# Altium schematic sheet EVENTCTRL_FPGA.SchDoc: FPGA
size A3; Author: ZLY; DocumentNumber: 9321-E-1102-EMRT EVENT CONTROLLER ACQ; Revision: 1.0; SheetNumber: 6; SheetTotal: 6
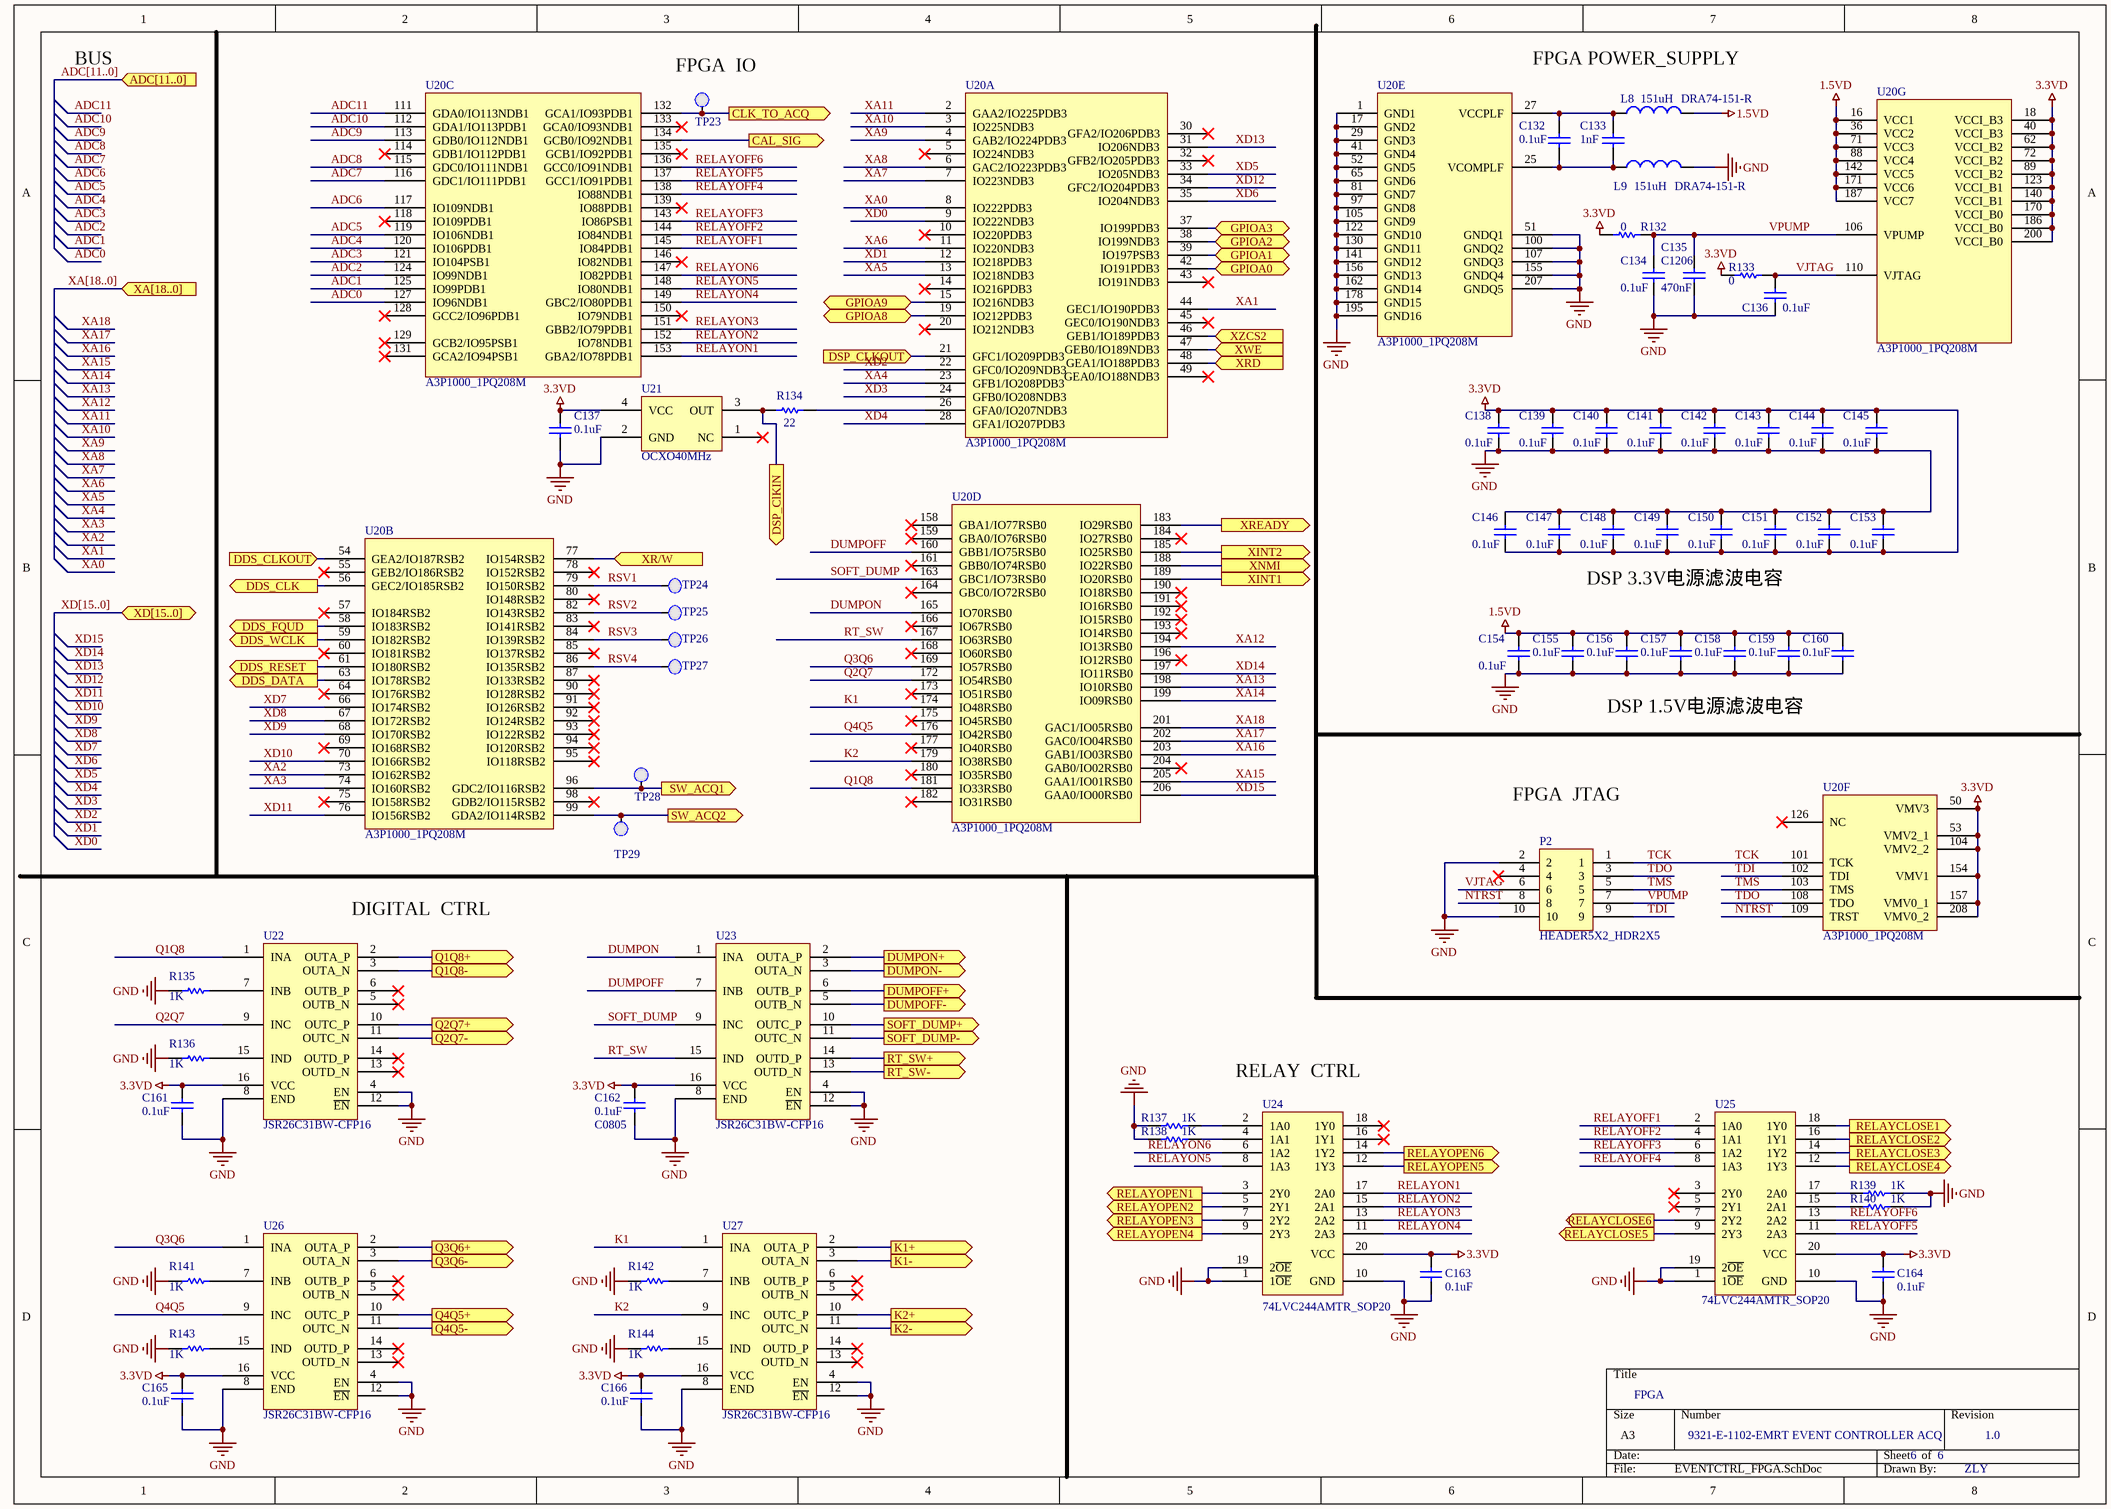
[diagram p0: EVENTCTRL_FPGA.SchDoc]

## Parts
C132  value 0.1uF  [0805]  (hidden comment: C0805)
C133  value 1nF  [0805]  (hidden comment: C0805)
C134  value 0.1uF  [0805]  (hidden comment: C0805)
C135  C1206  value 470nF  [1206]
C136  value 0.1uF  [0805]  (hidden comment: C0805)
C137  value 0.1uF  [0805]  (hidden comment: C0805)
C138  value 0.1uF  [0805]  (hidden comment: C0805)
C139  value 0.1uF  [0805]  (hidden comment: C0805)
C140  value 0.1uF  [0805]  (hidden comment: C0805)
C141  value 0.1uF  [0805]  (hidden comment: C0805)
C142  value 0.1uF  [0805]  (hidden comment: C0805)
C143  value 0.1uF  [0805]  (hidden comment: C0805)
C144  value 0.1uF  [0805]  (hidden comment: C0805)
C145  value 0.1uF  [0805]  (hidden comment: C0805)
C146  value 0.1uF  [0805]  (hidden comment: C0805)
C147  value 0.1uF  [0805]  (hidden comment: C0805)
C148  value 0.1uF  [0805]  (hidden comment: C0805)
C149  value 0.1uF  [0805]  (hidden comment: C0805)
C150  value 0.1uF  [0805]  (hidden comment: C0805)
C151  value 0.1uF  [0805]  (hidden comment: C0805)
C152  value 0.1uF  [0805]  (hidden comment: C0805)
C153  value 0.1uF  [0805]  (hidden comment: C0805)
C154  value 0.1uF  [0805]  (hidden comment: C0805)
C155  value 0.1uF  [0805]  (hidden comment: C0805)
C156  value 0.1uF  [0805]  (hidden comment: C0805)
C157  value 0.1uF  [0805]  (hidden comment: C0805)
C158  value 0.1uF  [0805]  (hidden comment: C0805)
C159  value 0.1uF  [0805]  (hidden comment: C0805)
C160  value 0.1uF  [0805]  (hidden comment: C0805)
C161  value 0.1uF  [0805]  (hidden comment: C0805)
C162  value 0.1uF  [0805]  (hidden comment: C0805)
C163  value 0.1uF  [0805]  (hidden comment: C0805)
C164  value 0.1uF  [0805]  (hidden comment: C0805)
C165  value 0.1uF  [0805]  (hidden comment: C0805)
C166  value 0.1uF  [0805]  (hidden comment: C0805)
L8  DRA74-151-R  value 151uH  [DRA74-151-R]
L9  DRA74-151-R  value 151uH  [DRA74-151-R]
P2  HEADER5X2_HDR2X5  [HDR2X5]
R132  value 0  [R0805]  (hidden comment: R0805)
R133  value 0  [R0805]  (hidden comment: R0805)
R134  value 22  [R0805]  (hidden comment: R0805)
R135  value 1K  [R0805]  (hidden comment: R0805)
R136  value 1K  [R0805]  (hidden comment: R0805)
R137  value 1K  [R0805]  (hidden comment: R0805)
R138  value 1K  [R0805]  (hidden comment: R0805)
R139  value 1K  [R0805]  (hidden comment: R0805)
R140  value 1K  [R0805]  (hidden comment: R0805)
R141  value 1K  [R0805]  (hidden comment: R0805)
R142  value 1K  [R0805]  (hidden comment: R0805)
R143  value 1K  [R0805]  (hidden comment: R0805)
R144  value 1K  [R0805]  (hidden comment: R0805)
TP23  TP  [TPA]  (value not drawn)
TP24  TP  [TPA]  (value not drawn)
TP25  TP  [TPA]  (value not drawn)
TP26  TP  [TPA]  (value not drawn)
TP27  TP  [TPA]  (value not drawn)
TP28  TP  [TPA]  (value not drawn)
TP29  TP  [TPA]  (value not drawn)
U20  A3P1000_1PQ208M  [PQFP208]  (parts A,B,C,D,E,F,G of 7)
U21  OCXO40MHz  [OCX1]
U22  JSR26C31BW-CFP16  [W16A]
U23  JSR26C31BW-CFP16  [W16A]
U24  74LVC244AMTR_SOP20  [SOP20]
U25  74LVC244AMTR_SOP20  [SOP20]
U26  JSR26C31BW-CFP16  [W16A]
U27  JSR26C31BW-CFP16  [W16A]

## Ports
ADC[11..0] (in), CAL_SIG (out), CLK_TO_ACQ (out), DDS_CLK (out), DDS_CLKOUT (in), DDS_DATA (out), DDS_FQUD (out), DDS_RESET (out), DDS_WCLK (out), DSP_ClKIN (out), DSP_CLKOUT (in), DUMPOFF+ (out), DUMPOFF- (out), DUMPON+ (out), DUMPON- (out), GPIOA0 (bidir), GPIOA1 (bidir), GPIOA2 (bidir), GPIOA3 (bidir), GPIOA8 (bidir), GPIOA9 (bidir), K1+ (out), K1- (out), K2+ (out), K2- (out), Q1Q8+ (out), Q1Q8- (out), Q2Q7+ (out), Q2Q7- (out), Q3Q6+ (out), Q3Q6- (out), Q4Q5+ (out), Q4Q5- (out), RELAYCLOSE1 (out), RELAYCLOSE2 (out), RELAYCLOSE3 (out), RELAYCLOSE4 (out), RELAYCLOSE5 (out), RELAYCLOSE6 (out), RELAYOPEN1 (out), RELAYOPEN2 (out), RELAYOPEN3 (out), RELAYOPEN4 (out), RELAYOPEN5 (out), RELAYOPEN6 (out), RT_SW+ (out), RT_SW- (out), SOFT_DUMP+ (out), SOFT_DUMP- (out), SW_ACQ1 (out), SW_ACQ2 (out), XA[18..0] (in), XD[15..0] (bidir), XINT1 (out), XINT2 (out), XNMI (out), XR/W (in), XRD (in), XREADY (out), XWE (in), XZCS2 (in)

## Nets
1.5VD: C154.1 C155.1 C156.1 C157.1 C158.1 C159.1 C160.1 L8.2 U20.16(VCC1) U20.36(VCC2) U20.71(VCC3) U20.88(VCC4) U20.142(VCC5) U20.171(VCC6) U20.187(VCC7)
3.3VD: C137.1 C138.1 C139.1 C140.1 C141.1 C142.1 C143.1 C144.1 C145.1 C146.2 C147.2 C148.2 C149.2 C150.2 C151.2 C152.2 C153.2 C161.1 C162.1 C163.2 C164.2 C165.1 C166.1 R132.1 R133.1 U20.18(VCCI_B3) U20.40(VCCI_B3) U20.50(VMV3) U20.53(VMV2_1) U20.62(VCCI_B2) U20.72(VCCI_B2) U20.89(VCCI_B2) U20.104(VMV2_2) U20.123(VCCI_B1) U20.140(VCCI_B1) U20.154(VMV1) U20.157(VMV0_1) U20.170(VCCI_B0) U20.186(VCCI_B0) U20.200(VCCI_B0) U20.208(VMV0_2) U21.4(VCC) U22.16(VCC) U23.16(VCC) U24.20(VCC) U25.20(VCC) U26.16(VCC) U27.16(VCC)
GND: C134.2 C135.2 C136.2 C137.2 C138.2 C139.2 C140.2 C141.2 C142.2 C143.2 C144.2 C145.2 C146.1 C147.1 C148.1 C149.1 C150.1 C151.1 C152.1 C153.1 C154.2 C155.2 C156.2 C157.2 C158.2 C159.2 C160.2 C161.2 C162.2 C163.1 C164.1 C165.2 C166.2 L9.2 P2.2 P2.10 R135.1 R136.1 R137.1 R138.1 R139.2 R140.2 R141.1 R142.1 R143.1 R144.1 U20.1(GND1) U20.17(GND2) U20.29(GND3) U20.41(GND4) U20.51(GNDQ1) U20.52(GND5) U20.65(GND6) U20.81(GND7) U20.97(GND8) U20.100(GNDQ2) U20.105(GND9) U20.107(GNDQ3) U20.122(GND10) U20.130(GND11) U20.141(GND12) U20.155(GNDQ4) U20.156(GND13) U20.162(GND14) U20.178(GND15) U20.195(GND16) U20.207(GNDQ5) U21.2(GND) U22.4(EN) U22.8(END) U22.12(~{EN}) U23.4(EN) U23.8(END) U23.12(~{EN}) U24.1(1~{OE}) U24.10(GND) U24.19(2~{OE}) U25.1(1~{OE}) U25.10(GND) U25.19(2~{OE}) U26.4(EN) U26.8(END) U26.12(~{EN}) U27.4(EN) U27.8(END) U27.12(~{EN})
ADC0: U20.127(IO96NDB1)
ADC1: U20.125(IO99PDB1)
ADC2: U20.124(IO99NDB1)
ADC3: U20.121(IO104PSB1)
ADC4: U20.120(IO106PDB1)
ADC5: U20.119(IO106NDB1)
ADC6: U20.117(IO109NDB1)
ADC7: U20.116(GDC1/IO111PDB1)
ADC8: U20.115(GDC0/IO111NDB1)
ADC9: U20.113(GDB0/IO112NDB1)
ADC10: U20.112(GDA1/IO113PDB1)
ADC11: U20.111(GDA0/IO113NDB1)
CAL_SIG: U20.134(GCB0/IO92NDB1) ; port CAL_SIG
CLK_TO_ACQ: TP23.1(TP) U20.132(GCA1/IO93PDB1) ; port CLK_TO_ACQ
DDS_CLK: U20.56(GEC2/IO185RSB2) ; port DDS_CLK
DDS_CLKOUT: U20.54(GEA2/IO187RSB2) ; port DDS_CLKOUT
DDS_DATA: U20.63(IO178RSB2) ; port DDS_DATA
DDS_FQUD: U20.58(IO183RSB2) ; port DDS_FQUD
DDS_RESET: U20.61(IO180RSB2) ; port DDS_RESET
DDS_WCLK: U20.59(IO182RSB2) ; port DDS_WCLK
DSP_ClKIN: R134.1 U21.3(OUT) ; port DSP_ClKIN
DSP_CLKOUT: U20.21(GFC1/IO209PDB3) ; port DSP_CLKOUT
DUMPOFF: U20.160(GBB1/IO75RSB0) U23.7(INB)
DUMPOFF+: U23.6(OUTB_P) ; port DUMPOFF+
DUMPOFF-: U23.5(OUTB_N) ; port DUMPOFF-
DUMPON: U20.165(IO70RSB0) U23.1(INA)
DUMPON+: U23.2(OUTA_P) ; port DUMPON+
DUMPON-: U23.3(OUTA_N) ; port DUMPON-
GPIOA0: U20.42(IO191PDB3) ; port GPIOA0
GPIOA1: U20.39(IO197PSB3) ; port GPIOA1
GPIOA2: U20.38(IO199NDB3) ; port GPIOA2
GPIOA3: U20.37(IO199PDB3) ; port GPIOA3
GPIOA8: U20.19(IO212PDB3) ; port GPIOA8
GPIOA9: U20.15(IO216NDB3) ; port GPIOA9
K1: U20.174(IO48RSB0) U27.1(INA)
K1+: U27.2(OUTA_P) ; port K1+
K1-: U27.3(OUTA_N) ; port K1-
K2: U20.179(IO38RSB0) U27.9(INC)
K2+: U27.10(OUTC_P) ; port K2+
K2-: U27.11(OUTC_N) ; port K2-
NTRST: P2.8 U20.109(TRST)
Q1Q8: U20.181(IO33RSB0) U22.1(INA)
Q1Q8+: U22.2(OUTA_P) ; port Q1Q8+
Q1Q8-: U22.3(OUTA_N) ; port Q1Q8-
Q2Q7: U20.172(IO54RSB0) U22.9(INC)
Q2Q7+: U22.10(OUTC_P) ; port Q2Q7+
Q2Q7-: U22.11(OUTC_N) ; port Q2Q7-
Q3Q6: U20.169(IO57RSB0) U26.1(INA)
Q3Q6+: U26.2(OUTA_P) ; port Q3Q6+
Q3Q6-: U26.3(OUTA_N) ; port Q3Q6-
Q4Q5: U20.176(IO42RSB0) U26.9(INC)
Q4Q5+: U26.10(OUTC_P) ; port Q4Q5+
Q4Q5-: U26.11(OUTC_N) ; port Q4Q5-
RELAYCLOSE1: U25.18(1Y0) ; port RELAYCLOSE1
RELAYCLOSE2: U25.16(1Y1) ; port RELAYCLOSE2
RELAYCLOSE3: U25.14(1Y2) ; port RELAYCLOSE3
RELAYCLOSE4: U25.12(1Y3) ; port RELAYCLOSE4
RELAYCLOSE5: U25.9(2Y3) ; port RELAYCLOSE5
RELAYCLOSE6: U25.7(2Y2) ; port RELAYCLOSE6
RELAYOFF1: U20.145(IO84PDB1) U25.2(1A0)
RELAYOFF2: U20.144(IO84NDB1) U25.4(1A1)
RELAYOFF3: U20.143(IO86PSB1) U25.6(1A2)
RELAYOFF4: U20.138(IO88NDB1) U25.8(1A3)
RELAYOFF5: U20.137(GCC1/IO91PDB1) U25.11(2A3)
RELAYOFF6: U20.136(GCC0/IO91NDB1) U25.13(2A2)
RELAYON1: U20.153(GBA2/IO78PDB1) U24.17(2A0)
RELAYON2: U20.152(IO78NDB1) U24.15(2A1)
RELAYON3: U20.151(GBB2/IO79PDB1) U24.13(2A2)
RELAYON4: U20.149(GBC2/IO80PDB1) U24.11(2A3)
RELAYON5: U20.148(IO80NDB1) U24.8(1A3)
RELAYON6: U20.147(IO82PDB1) U24.6(1A2)
RELAYOPEN1: U24.3(2Y0) ; port RELAYOPEN1
RELAYOPEN2: U24.5(2Y1) ; port RELAYOPEN2
RELAYOPEN3: U24.7(2Y2) ; port RELAYOPEN3
RELAYOPEN4: U24.9(2Y3) ; port RELAYOPEN4
RELAYOPEN5: U24.12(1Y3) ; port RELAYOPEN5
RELAYOPEN6: U24.14(1Y2) ; port RELAYOPEN6
RSV1: TP24.1(TP) U20.79(IO150RSB2)
RSV2: TP25.1(TP) U20.82(IO143RSB2)
RSV3: TP26.1(TP) U20.84(IO139RSB2)
RSV4: TP27.1(TP) U20.86(IO135RSB2)
RT_SW: U20.167(IO63RSB0) U23.15(IND)
RT_SW+: U23.14(OUTD_P) ; port RT_SW+
RT_SW-: U23.13(OUTD_N) ; port RT_SW-
SOFT_DUMP: U20.163(GBC1/IO73RSB0) U23.9(INC)
SOFT_DUMP+: U23.10(OUTC_P) ; port SOFT_DUMP+
SOFT_DUMP-: U23.11(OUTC_N) ; port SOFT_DUMP-
SW_ACQ1: TP28.1(TP) U20.96(GDC2/IO116RSB2) ; port SW_ACQ1
SW_ACQ2: TP29.1(TP) U20.99(GDA2/IO114RSB2) ; port SW_ACQ2
TCK: P2.1 U20.101(TCK)
TDI: P2.9 U20.102(TDI)
TDO: P2.3 U20.108(TDO)
TMS: P2.5 U20.103(TMS)
VJTAG: C136.1 P2.6 R133.2 U20.110(VJTAG)
VPUMP: C134.1 C135.1 P2.7 R132.2 U20.106(VPUMP)
XA0: U20.8(IO222PDB3)
XA1: U20.44(GEC1/IO190PDB3)
XA2: U20.73(IO162RSB2)
XA3: U20.74(IO160RSB2)
XA4: U20.23(GFB1/IO208PDB3)
XA5: U20.13(IO218NDB3)
XA6: U20.11(IO220NDB3)
XA7: U20.7(IO223NDB3)
XA8: U20.6(GAC2/IO223PDB3)
XA9: U20.4(GAB2/IO224PDB3)
XA10: U20.3(IO225NDB3)
XA11: U20.2(GAA2/IO225PDB3)
XA12: U20.194(IO13RSB0)
XA13: U20.198(IO10RSB0)
XA14: U20.199(IO09RSB0)
XA15: U20.205(GAA1/IO01RSB0)
XA16: U20.203(GAB1/IO03RSB0)
XA17: U20.202(GAC0/IO04RSB0)
XA18: U20.201(GAC1/IO05RSB0)
XD0: U20.9(IO222NDB3)
XD1: U20.12(IO218PDB3)
XD2: U20.22(GFC0/IO209NDB3)
XD3: U20.24(GFB0/IO208NDB3)
XD4: U20.28(GFA1/IO207PDB3)
XD5: U20.33(IO205NDB3)
XD6: U20.35(IO204NDB3)
XD7: U20.66(IO174RSB2)
XD8: U20.67(IO172RSB2)
XD9: U20.68(IO170RSB2)
XD10: U20.70(IO166RSB2)
XD11: U20.76(IO156RSB2)
XD12: U20.34(GFC2/IO204PDB3)
XD13: U20.31(IO206NDB3)
XD14: U20.197(IO11RSB0)
XD15: U20.206(GAA0/IO00RSB0)
XINT1: U20.189(IO20RSB0) ; port XINT1
XINT2: U20.185(IO25RSB0) ; port XINT2
XNMI: U20.188(IO22RSB0) ; port XNMI
XR/W: U20.77(IO154RSB2) ; port XR/W
XRD: U20.48(GEA1/IO188PDB3) ; port XRD
XREADY: U20.183(IO29RSB0) ; port XREADY
XWE: U20.47(GEB0/IO189NDB3) ; port XWE
XZCS2: U20.46(GEB1/IO189PDB3) ; port XZCS2
NetC132_1: C132.1 C133.1 L8.1 U20.27(VCCPLF)
NetC132_2: C132.2 C133.2 L9.1 U20.25(VCOMPLF)
NetR134_2: R134.2 U20.26(GFA0/IO207NDB3)
NetR135_2: R135.2 U22.7(INB)
NetR136_2: R136.2 U22.15(IND)
NetR137_2: R137.2 U24.2(1A0)
NetR138_2: R138.2 U24.4(1A1)
NetR139_1: R139.1 U25.17(2A0)
NetR140_1: R140.1 U25.15(2A1)
NetR141_2: R141.2 U26.7(INB)
NetR142_2: R142.2 U27.7(INB)
NetR143_2: R143.2 U26.15(IND)
NetR144_2: R144.2 U27.15(IND)

Not connected (* = marked no-connect by the designer): P2 4*; U20 5(IO224NDB3)* 10(IO220PDB3)* 14(IO216PDB3)* 20(IO212NDB3)* 30(GFA2/IO206PDB3)* 32(GFB2/IO205PDB3)* 43(IO191NDB3)* 45(GEC0/IO190NDB3)* 49(GEA0/IO188NDB3)* 55(GEB2/IO186RSB2)* 57(IO184RSB2)* 60(IO181RSB2)* 64(IO176RSB2)* 69(IO168RSB2)* 75(IO158RSB2)* 78(IO152RSB2)* 80(IO148RSB2)* 83(IO141RSB2)* 85(IO137RSB2)* 87(IO133RSB2)* 90(IO128RSB2)* 91(IO126RSB2)* 92(IO124RSB2)* 93(IO122RSB2)* 94(IO120RSB2)* 95(IO118RSB2)* 98(GDB2/IO115RSB2)* 114(GDB1/IO112PDB1)* 118(IO109PDB1)* 126(NC)* 128(GCC2/IO96PDB1)* 129(GCB2/IO95PSB1)* 131(GCA2/IO94PSB1)* 133(GCA0/IO93NDB1)* 135(GCB1/IO92PDB1)* 139(IO88PDB1)* 146(IO82NDB1)* 150(IO79NDB1)* 158(GBA1/IO77RSB0)* 159(GBA0/IO76RSB0)* 161(GBB0/IO74RSB0)* 164(GBC0/IO72RSB0)* 166(IO67RSB0)* 168(IO60RSB0)* 173(IO51RSB0)* 175(IO45RSB0)* 177(IO40RSB0)* 180(IO35RSB0)* 182(IO31RSB0)* 184(IO27RSB0)* 190(IO18RSB0)* 191(IO16RSB0)* 192(IO15RSB0)* 193(IO14RSB0)* 196(IO12RSB0)* 204(GAB0/IO02RSB0)*; U21 1(NC)*; U22 5(OUTB_N)* 6(OUTB_P)* 13(OUTD_N)* 14(OUTD_P)*; U24 16(1Y1)* 18(1Y0)*; U25 3(2Y0)* 5(2Y1)*; U26 5(OUTB_N)* 6(OUTB_P)* 13(OUTD_N)* 14(OUTD_P)*; U27 5(OUTB_N)* 6(OUTB_P)* 13(OUTD_N)* 14(OUTD_P)*

## Buses and harness runs
bus ADC[11..0] = port ADC[11..0]
bus XA[18..0] = port XA[18..0]
bus XD[15..0] = port XD[15..0]

## Notes on the sheet
- BUS
- (near TP23) FPGA  IO
- FPGA POWER_SUPPLY
- DSP 3.3V电源滤波电容
- DSP 1.5V电源滤波电容
- FPGA  JTAG
- (near U22) DIGITAL  CTRL
- RELAY  CTRL

## Library data of the parts
C132-C166 = Cap: Capacitor
  C132-C134 C136-C154 C156-C166: PackageReference: C0805
  C135: PackageReference: 1206
  C155: PackageReference: 0.1uF
L8 L9 = Inductor
P2 = JTAG_PORT10
R132-R144 = Res1: Resistor; PackageReference: R0805
U20 = A3P1000
U21 = OCXO
U22 U23 U26 U27 = JSR26C31
U24 U25 = 74HC244